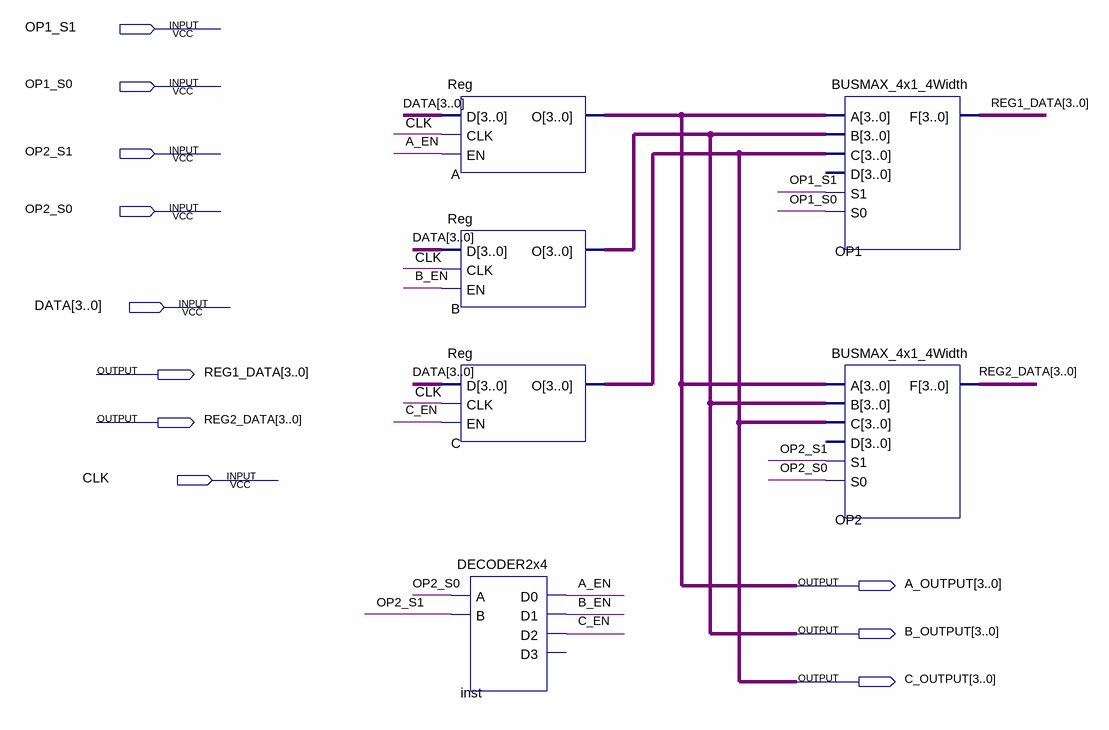
[diagram p0: schematic sheet]
// Quartus schematic REGFILE.bdf as structural Verilog: 6 symbols, 11 pins
module REGFILE (
  input  OP1_S1,
  input  OP1_S0,
  input  OP2_S1,
  input  OP2_S0,
  input  [3:0] DATA,
  input  CLK,
  output [3:0] REG1_DATA,
  output [3:0] REG2_DATA,
  output [3:0] A_OUTPUT,
  output [3:0] B_OUTPUT,
  output [3:0] C_OUTPUT
);

  wire A_EN, B_EN, C_EN;

  Reg A (.D(DATA), .CLK(CLK), .EN(A_EN), .O(A_OUTPUT));
  Reg B (.D(DATA), .CLK(CLK), .EN(B_EN), .O(B_OUTPUT));
  Reg C (.D(DATA), .CLK(CLK), .EN(C_EN), .O(C_OUTPUT));
  DECODER2x4 inst (.A(OP2_S0), .B(OP2_S1), .D0(A_EN), .D1(B_EN), .D2(C_EN));  // open: D3
  BUSMAX_4x1_4Width OP1 (.A(A_OUTPUT), .B(B_OUTPUT), .C(C_OUTPUT), .S1(OP1_S1), .S0(OP1_S0), .F(REG1_DATA));  // open: D
  BUSMAX_4x1_4Width OP2 (.A(A_OUTPUT), .B(B_OUTPUT), .C(C_OUTPUT), .S1(OP2_S1), .S0(OP2_S0), .F(REG2_DATA));  // open: D
endmodule
